# Altium project Iot_board_esp8266.PrjPcb (part 2 of 3)
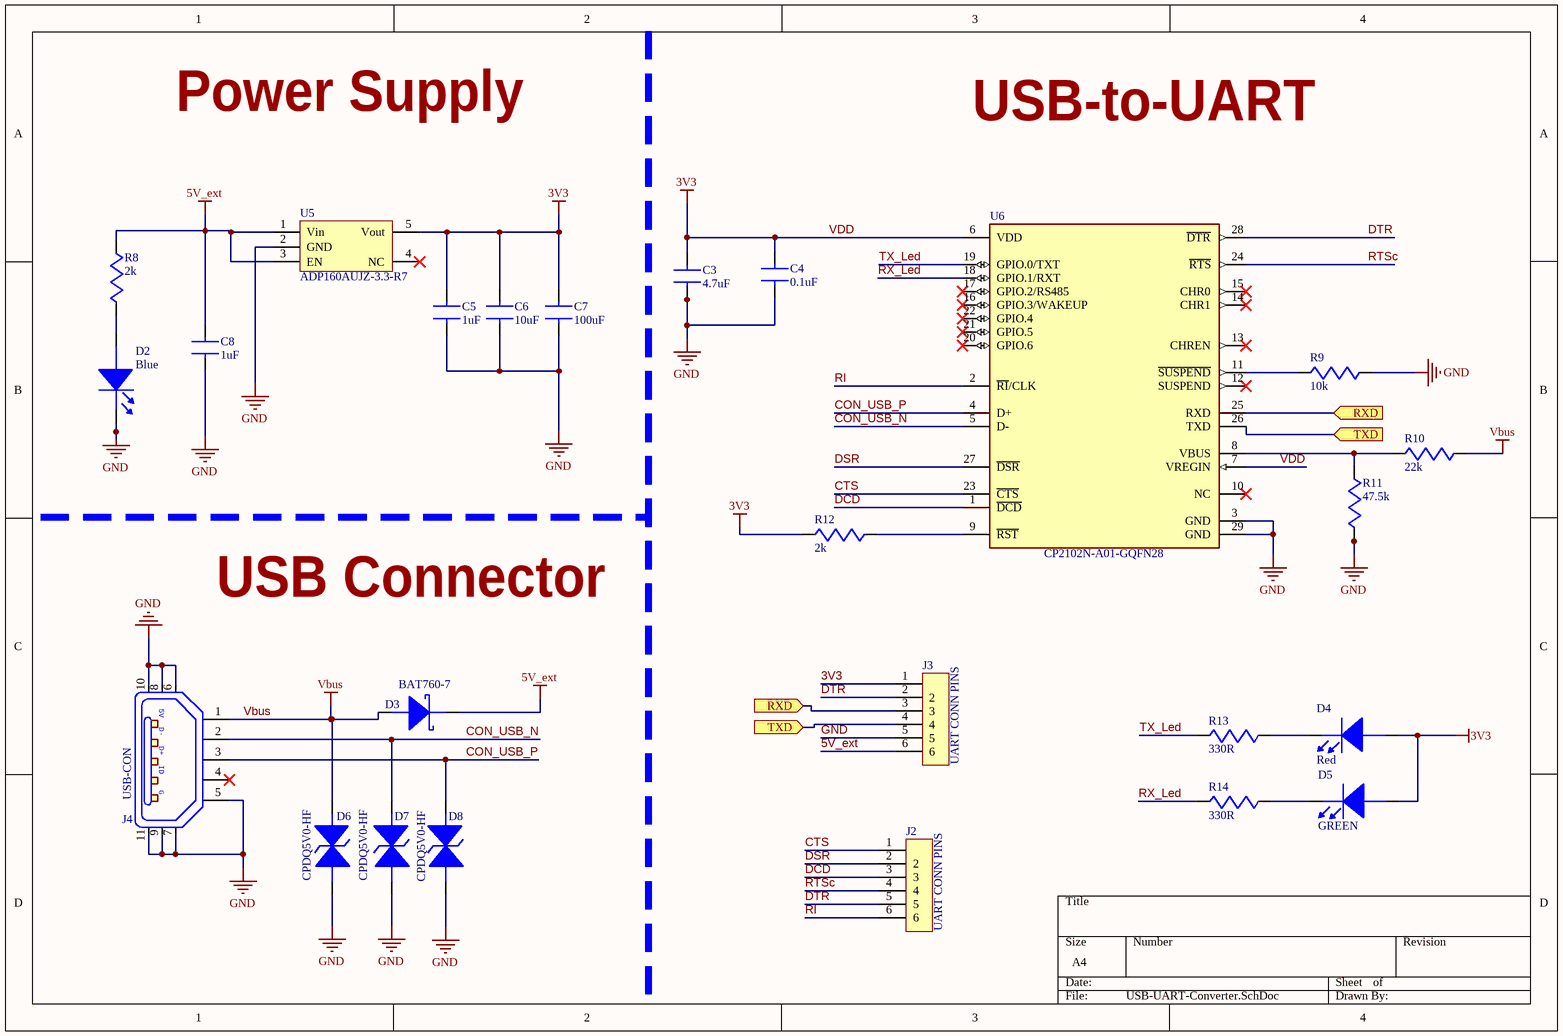
[diagram p3: USB-UART-Converter.SchDoc]

## Sheet USB-UART-Converter.SchDoc (continued)
### Library data of the parts
C3 = C0603C475K9PACTU: KEMET - C0603C475K9PACTU - SMD Multilayer Ceramic Capacitor, 4.7 µF, 6.3 V, 0603 [1608 Metric], ± 10%, X5R, C Series KEMET; Voltage Rating (DC): 6.3V; Dissipation Factor: 5%; Supplier 1: Digi-Key; Supplier Part Number 1: 399-3482-1-ND; Manufacturer: KEMET; Manufacturer Part Number: C0603C475K9PACTU; RoHS: Yes; Category: Ceramic Capacitors; Stock 1: 1092737; Pricing 1: 1=0,16000, 10=0,11500, 50=0,06520, 100=0,05410, 500=0,03792, 1000=0,03139 (USD); Mount: Surface Mount,PCB; Case/Package: 0603; Number of Pins: 2; Case Code (Metric): 1608; Case Code (Imperial): 0603; Dielectric Material: Ceramic; Contact Plating: Tin,Matte; Min Operating Temperature: -55°C; Max Operating Temperature: 85°C; Package Quantity: 1; Capacitance: 4.7uF; Tolerance: 10%; Packaging: Tape and Reel; Voltage Rating: 6.3V; Dielectric: X5R; Termination: SMD/SMT; Voltage: 6.3V; Series: C; Construction: Flat; Length: 1.6mm; Width: 0.031inch; Height: 0.8mm; Depth: 0.8mm; Thickness: 0.035inch; Lead Pitch: 0.7mm; Radiation Hardening: No; REACH SVHC: No SVHC; Lead Free: Lead Free; RoHS Compliant: Yes; ComponentLink1URL: https://datasheet.ciiva.com/145/docfinderpartnumber-c0603c475k9pactu-145072.pdf?src-supplier=Digi-Key; ComponentLink1Description: https://datasheet.ciiva.com/145/docfinderpartnumber-c0603c475k9pactu-145072.pdf?src-supplier=Digi-Key; ComponentLink2URL: https://datasheet.ciiva.com/7823/1732700-7823808.pdf?src-supplier=Element14; ComponentLink2Description: https://datasheet.ciiva.com/7823/1732700-7823808.pdf?src-supplier=Element14; ComponentLink3URL: https://datasheet.ciiva.com/28682/1789732-28682301.pdf?src-supplier=Element14; ComponentLink3Description: https://datasheet.ciiva.com/28682/1789732-28682301.pdf?src-supplier=Element14; ComponentLink4URL: https://datasheet.ciiva.com/7824/40889-7824047.pdf?src-supplier=Element14; ComponentLink4Description: https://datasheet.ciiva.com/7824/40889-7824047.pdf?src-supplier=Element14
C4 = C0603C104K5RACTU: KEMET - C0603C104K5RACTU - SMD Multilayer Ceramic Capacitor, 0.1 µF, 50 V, 0603 [1608 Metric], ± 10%, X7R, C Series KEMET; Capacitance: 100nF; Voltage Rating: 50V; Dissipation Factor: 2.5%; Supplier 1: Digi-Key; Supplier Part Number 1: 399-5089-1-ND; Manufacturer: KEMET; Manufacturer Part Number: C0603C104K5RACTU; RoHS: Yes; Category: Ceramic Capacitors; Stock 1: 4652879; Pricing 1: 1=0,12000, 10=0,08500, 50=0,04620, 100=0,03770, 500=0,02696, 1000=0,02118 (USD); Mount: Surface Mount; Case/Package: 0603; Number of Pins: 2; Case Code (Metric): 1608; Case Code (Imperial): 0603; Dielectric Material: Ceramic; Contact Plating: Tin,Matte; Min Operating Temperature: -55°C; Max Operating Temperature: 125°C; Tolerance: 10%; Packaging: Tape and Reel; Dielectric: X7R; Voltage Rating (DC): 50V; Package Quantity: 1; Termination: SMD/SMT; Voltage: 50V; Series: SMD Comm X7R; Length: 0.063inch; Width: 0.031inch; Height: 0.8mm; Depth: 0.8mm; Thickness: 0.034inch; Lead Pitch: 0.7mm; Radiation Hardening: No; REACH SVHC: No SVHC; RoHS Compliant: Yes
C5 C8 = C0603C105K8PACTU: Cap Ceramic 1uF 10V X5R 10% SMD 0603 85°C Paper T/R; Manufacturer: KEMET; Supplier 1: Digi-Key; Supplier Part Number 1: 399-3118-1-ND; Manufacturer Part Number: C0603C105K8PACTU; RoHS: Yes; Category: Ceramic Capacitors; Stock 1: 515304; Pricing 1: 1=0,10000, 10=0,05300, 50=0,02900, 100=0,02370, 500=0,01694, 1000=0,01331 (USD); Mount: Surface Mount; Case/Package: 0603; Number of Pins: 2; Case Code (Imperial): 0603; Case Code (Metric): 1608; Dielectric Material: Ceramic; Weight: 7.1E-05oz; Min Operating Temperature: -55°C; Max Operating Temperature: 85°C; Tolerance: 10%; Capacitance: 1uF; Packaging: Tape and Reel; Package Quantity: 1; Voltage Rating: 10V; Termination: SMD/SMT; Voltage Rating (DC): 10V; Dielectric: X5R; Voltage: 10V; Series: C; Construction: Flat; Length: 1.6mm; Width: 0.031inch; Height: 0.8mm; Depth: 0.8mm; Thickness: 0.035inch; Radiation Hardening: No; REACH SVHC: No SVHC; RoHS Compliant: Yes; Lead Free: Lead Free; ComponentLink1URL: https://datasheet.ciiva.com/11787/0900766b8116eb59-11787747.pdf?src-supplier=RSComponents; ComponentLink1Description: https://datasheet.ciiva.com/11787/0900766b8116eb59-11787747.pdf?src-supplier=RSComponents; ComponentLink2URL: https://datasheet.ciiva.com/6074/40889-6074647.pdf?src-supplier=Farnell; ComponentLink2Description: https://datasheet.ciiva.com/6074/40889-6074647.pdf?src-supplier=Farnell; ComponentLink3URL: https://datasheet.ciiva.com/28645/1831760-28645655.pdf?src-supplier=Element14; ComponentLink3Description: https://datasheet.ciiva.com/28645/1831760-28645655.pdf?src-supplier=Element14; ComponentLink4URL: https://datasheet.ciiva.com/26847/getdatasheetpartid-385480-26847548.pdf?src-supplier=Verical; ComponentLink4Description: https://datasheet.ciiva.com/26847/getdatasheetpartid-385480-26847548.pdf?src-supplier=Verical; ComponentLink5URL: https://datasheet.ciiva.com/7823/40889-7823998.pdf?src-supplier=Element14; ComponentLink5Description: https://datasheet.ciiva.com/7823/40889-7823998.pdf?src-supplier=Element14; ComponentLink6URL: https://datasheet.ciiva.com/7823/1929483-7823999.pdf?src-supplier=Element14; ComponentLink6Description: https://datasheet.ciiva.com/7823/1929483-7823999.pdf?src-supplier=Element14
C6 = C0603C106M9PACTU: KEMET - C0603C106M9PACTU - CAP, MLCC, X5R, 10UF, 6.3V, 0603; Dielectric Material: Ceramic; Tolerance: 20%; Supplier 1: Digi-Key; Supplier Part Number 1: 399-5504-1-ND; Manufacturer: KEMET; Manufacturer Part Number: C0603C106M9PACTU; RoHS: Yes; Category: Ceramic Capacitors; Stock 1: 149663; Pricing 1: 1=0,31000, 10=0,21100, 50=0,14040, 100=0,11930, 500=0,08422, 1000=0,07369 (USD); Mount: PCB,Surface Mount; Case/Package: 0603; Number of Pins: 2; Case Code (Imperial): 0603; Case Code (Metric): 1608; Min Operating Temperature: -55°C; Max Operating Temperature: 85°C; Capacitance: 10uF; Packaging: Tape and Reel; Voltage: 6.3V; Termination: SMD/SMT; Package Quantity: 4000; Voltage Rating: 6.3V; Voltage Rating (DC): 6.3V; Series: C0603C; Dielectric: X5R; Construction: Flat; Length: 1.6mm; Height: 0.8mm; Depth: 0.8mm; Radiation Hardening: No; REACH SVHC: No SVHC; RoHS Compliant: Yes; ComponentLink1URL: http://components.arrow.com/part/dataview/42932973S8313645N7429?src-supplier=Arrow+Electronics; ComponentLink1Description: http://components.arrow.com/part/dataview/42932973S8313645N7429?src-supplier=Arrow+Electronics; ComponentLink2URL: http://www.farnell.com/datasheets/2739682.pdf?src-supplier=Farnell; ComponentLink2Description: http://www.farnell.com/datasheets/2739682.pdf?src-supplier=Farnell; ComponentLink3URL: http://uk.rs-online.com/webdocs/1515/0900766b8151511d.pdf?src-supplier=RSComponents; ComponentLink3Description: http://uk.rs-online.com/webdocs/1515/0900766b8151511d.pdf?src-supplier=RSComponents; ComponentLink4URL: http://www.farnell.com/datasheets/1918694.pdf?src-supplier=Farnell; ComponentLink4Description: http://www.farnell.com/datasheets/1918694.pdf?src-supplier=Farnell; ComponentLink5URL: http://components.arrow.com/part/dataview/0323_00011321?src-supplier=Arrow+Europe; ComponentLink5Description: http://components.arrow.com/part/dataview/0323_00011321?src-supplier=Arrow+Europe; ComponentLink6URL: https://www.verical.com/server-webapp/html/getDatasheet?partID=353664&src-supplier=Verical; ComponentLink6Description: https://www.verical.com/server-webapp/html/getDatasheet?partID=353664&src-supplier=Verical; ComponentLink7URL: http://www.farnell.com/datasheets/2739682.pdf?src-supplier=Element14; ComponentLink7Description: http://www.farnell.com/datasheets/2739682.pdf?src-supplier=Element14; ComponentLink8URL: https://api.kemet.com/component-edge/download/datasheet/C0603C106M9PACTU.pdf?src-supplier=Digi-Key; ComponentLink8Description: https://api.kemet.com/component-edge/download/datasheet/C0603C106M9PACTU.pdf?src-supplier=Digi-Key; ComponentLink9URL: http://www.farnell.com/datasheets/2315129.pdf?src-supplier=Verical; ComponentLink9Description: http://www.farnell.com/datasheets/2315129.pdf?src-supplier=Verical; ComponentLink10URL: http://www.farnell.com/datasheets/2315129.pdf?src-supplier=Avnet+Asia; ComponentLink10Description: http://www.farnell.com/datasheets/2315129.pdf?src-supplier=Avnet+Asia; ComponentLink11URL: http://www.kemet.com/kemet/web/homepage/kechome.nsf/weben/ADB5E2666EC6BA90CA2570A50016092E/$file/KEM_C1005_Y5V_SMD.pdf?src-supplier=Avnet; ComponentLink11Description: http://www.kemet.com/kemet/web/homepage/kechome.nsf/weben/ADB5E2666EC6BA90CA2570A50016092E/$file/KEM_C1005_Y5V_SMD.pdf?src-supplier=Avnet; ComponentLink12URL: http://www.farnell.com/datasheets/2315129.pdf?src-supplier=RSComponents; ComponentLink12Description: http://www.farnell.com/datasheets/2315129.pdf?src-supplier=RSComponents; ComponentLink13URL: http://www.farnell.com/datasheets/2739682.pdf?src-supplier=Newark; ComponentLink13Description: http://www.farnell.com/datasheets/2739682.pdf?src-supplier=Newark; ComponentLink14URL: http://www.farnell.com/datasheets/2315129.pdf?src-supplier=Allied+Electronics; ComponentLink14Description: http://www.farnell.com/datasheets/2315129.pdf?src-supplier=Allied+Electronics; ComponentLink15URL: http://www.farnell.com/datasheets/2315129.pdf?src-supplier=Mouser; ComponentLink15Description: http://www.farnell.com/datasheets/2315129.pdf?src-supplier=Mouser; ComponentLink16URL: http://capacitoredge.kemet.com/capedge2/DataSheet?pn=C0603C106M9PAC7867&src-supplier=Avnet; ComponentLink16Description: http://capacitoredge.kemet.com/capedge2/DataSheet?pn=C0603C106M9PAC7867&src-supplier=Avnet; ComponentLink17URL: http://www.farnell.com/datasheets/2315129.pdf?src-supplier=Distrelec; ComponentLink17Description: http://www.farnell.com/datasheets/2315129.pdf?src-supplier=Distrelec; ComponentLink18URL: http://www.kemet.com/kemet/web/homepage/kechome.nsf/file/Commercial%20Ceramic%20Chips%20X5R%20Dielectric/$file/KEM_C1006_X5R_SMD.pdf?src-supplier=Element14; ComponentLink18Description: http://www.kemet.com/kemet/web/homepage/kechome.nsf/file/Commercial%20Ceramic%20Chips%20X5R%20Dielectric/$file/KEM_C1006_X5R_SMD.pdf?src-supplier=Element14; ComponentLink19URL: http://www.farnell.com/datasheets/2315129.pdf?src-supplier=TTI; ComponentLink19Description: http://www.farnell.com/datasheets/2315129.pdf?src-supplier=TTI; ComponentLink20URL: http://www.farnell.com/datasheets/2315129.pdf?src-supplier=Quest; ComponentLink20Description: http://www.farnell.com/datasheets/2315129.pdf?src-supplier=Quest; ComponentLink21URL: http://www.farnell.com/datasheets/2315129.pdf?src-supplier=TME; ComponentLink21Description: http://www.farnell.com/datasheets/2315129.pdf?src-supplier=TME
C7 = C1206C107M9PACTU: KEMET - C1206C107M9PACTU - CAP, 100µF, 6.3V, 20%, X5R, 1206; Dielectric Material: Ceramic; Tolerance: 2%; Dissipation Factor: 5%; Supplier 1: Digi-Key; Supplier Part Number 1: 399-5620-1-ND; Manufacturer: KEMET; Manufacturer Part Number: C1206C107M9PACTU; RoHS: Yes; Category: Ceramic Capacitors; Stock 1: 170758; Pricing 1: 1=1,10000, 10=0,86600, 50=0,75080, 100=0,64970, 500=0,49088, 1000=0,43312 (USD); Mount: Surface Mount,PCB; Case/Package: 1206; Number of Pins: 2; Case Code (Metric): 3216; Case Code (Imperial): 1206; Min Operating Temperature: -55°C; Max Operating Temperature: 85°C; Capacitance: 100uF; Voltage Rating: 6.3V; Voltage Rating (DC): 6.3V; Package Quantity: 1; Packaging: Tape and Reel; Termination: SMD/SMT; Voltage: 6.3V; Series: C; Construction: Flat; Dielectric: X5R; Length: 3.2mm; Width: 0.063inch; Height: 1.6mm; Depth: 1.6mm; Thickness: 0.071inch; Radiation Hardening: No; REACH SVHC: No SVHC; RoHS Compliant: Yes; Lead Free: Lead Free; ComponentLink1URL: https://datasheet.ciiva.com/6161/1732717-6161699.pdf?src-supplier=Farnell; ComponentLink1Description: https://datasheet.ciiva.com/6161/1732717-6161699.pdf?src-supplier=Farnell; ComponentLink2URL: https://datasheet.ciiva.com/7729/1732717-7729830.pdf?src-supplier=Element14; ComponentLink2Description: https://datasheet.ciiva.com/7729/1732717-7729830.pdf?src-supplier=Element14; ComponentLink3URL: https://datasheet.ciiva.com/7729/1732717-7729831.pdf?src-supplier=Element14; ComponentLink3Description: https://datasheet.ciiva.com/7729/1732717-7729831.pdf?src-supplier=Element14; ComponentLink4URL: https://datasheet.ciiva.com/14589/70095383-14589256.pdf?src-supplier=Allied+Electronics; ComponentLink4Description: https://datasheet.ciiva.com/14589/70095383-14589256.pdf?src-supplier=Allied+Electronics; ComponentLink5URL: https://datasheet.ciiva.com/22749/1918694-22749624.pdf?src-supplier=Element14; ComponentLink5Description: https://datasheet.ciiva.com/22749/1918694-22749624.pdf?src-supplier=Element14; ComponentLink6URL: https://datasheet.ciiva.com/6114/40889-6114911.pdf?src-supplier=Farnell; ComponentLink6Description: https://datasheet.ciiva.com/6114/40889-6114911.pdf?src-supplier=Farnell; ComponentLink7URL: https://datasheet.ciiva.com/14592/70095383-14592223.pdf?src-supplier=Allied+Electronics; ComponentLink7Description: https://datasheet.ciiva.com/14592/70095383-14592223.pdf?src-supplier=Allied+Electronics
D2 = LTST-C191TBKT: LED BLUE CLEAR 0603 SMD; Manufacturer: Vishay Lite-On; Lens Color: Colorless; Forward Voltage: 3.8V; Forward Current: 20mA; Viewing Angle: 130°; Lens Style: Diffused,Colorless,Clear,Rectangular; Dominant Wavelength: 475nm; Luminous Intensity: 180mcd; Wavelength: 468nm; Number of LEDs: 1; Reverse Voltage: 5V; Power Dissipation: 76mW; Max Power Dissipation: 75mW; Supplier 1: Digi-Key; Supplier Part Number 1: 160-1647-1-ND; Manufacturer Part Number: LTST-C191TBKT; RoHS: Yes; Category: LEDs; Stock 1: 244513; Pricing 1: 1=0,33000, 10=0,26200, 100=0,11780, 500=0,10640, 1000=0,08740, 2000=0,07600 (USD); Mount: Surface Mount; Case/Package: 0603; Number of Pins: 2; Color: Blue; Case Code (Metric): 1608; Case Code (Imperial): 0603; Min Operating Temperature: -20°C; Max Operating Temperature: 80°C; Packaging: Tape and Reel; Package Quantity: 1; Test Current: 20mA; Illumination Color: Blue; Lens Transparency: Clear; Number of Elements: 1; Length: 0.8mm; Width: 0.8mm; Height: 0.55mm; Depth: 1.6mm; Radiation Hardening: No; RoHS Compliant: Yes; Lead Free: Lead Free; ComponentLink1URL: https://datasheet.ciiva.com/2110/ltst-c191tbkt-2110256.pdf?src-supplier=Digi-Key; ComponentLink1Description: https://datasheet.ciiva.com/2110/ltst-c191tbkt-2110256.pdf?src-supplier=Digi-Key; ComponentLink2URL: https://datasheet.ciiva.com/12400/lite-on-ltst-c191tbkt-187207-12400737.pdf?src-supplier=Mouser; ComponentLink2Description: https://datasheet.ciiva.com/12400/lite-on-ltst-c191tbkt-187207-12400737.pdf?src-supplier=Mouser; ComponentLink3URL: https://datasheet.ciiva.com/19465/2047945-19465673.pdf?src-supplier=Jameco; ComponentLink3Description: https://datasheet.ciiva.com/19465/2047945-19465673.pdf?src-supplier=Jameco; ComponentLink4URL: https://datasheet.ciiva.com/11774/0900766b80dc02b4-11774413.pdf?src-supplier=RSComponents; ComponentLink4Description: https://datasheet.ciiva.com/11774/0900766b80dc02b4-11774413.pdf?src-supplier=RSComponents; ComponentLink5URL: https://datasheet.ciiva.com/15117/getdatasheetpartid-133342-15117680.pdf?src-supplier=Verical; ComponentLink5Description: https://datasheet.ciiva.com/15117/getdatasheetpartid-133342-15117680.pdf?src-supplier=Verical; ComponentLink6URL: https://datasheet.ciiva.com/16444/ltst-c191tbkt-16444756.pdf?src-supplier=Future+Electronics; ComponentLink6Description: https://datasheet.ciiva.com/16444/ltst-c191tbkt-16444756.pdf?src-supplier=Future+Electronics; ComponentLink7URL: https://datasheet.ciiva.com/26913/ltst-c191tbkt-26913718.pdf?src-supplier=IIIC; ComponentLink7Description: https://datasheet.ciiva.com/26913/ltst-c191tbkt-26913718.pdf?src-supplier=IIIC; ComponentLink8URL: https://datasheet.ciiva.com/2110/s-110-ltst-c191tbkt-2110257.pdf?src-supplier=Digi-Key; ComponentLink8Description: https://datasheet.ciiva.com/2110/s-110-ltst-c191tbkt-2110257.pdf?src-supplier=Digi-Key
D3 = BAT760-7: DIODE SCHOTTKY 30V 1A SOD323; Manufacturer: Diodes; Element Configuration: Single; Peak Non-Repetitive Surge Current: 5.5A; Polarity: Standard; Capacitance: 25pF; Max Power Dissipation: 235mW; Forward Voltage: 550mV; Max Reverse Current: 50uA; Supplier 1: Digi-Key; Supplier Part Number 1: BAT760DICT-ND; Manufacturer Part Number: BAT760-7; RoHS: Yes; Category: Schottky Diodes; Stock 1: 214; Pricing 1: 1=0,53000, 10=0,45000, 100=0,31200, 500=0,24360, 1000=0,19800 (USD); Mount: Surface Mount; Number of Pins: 2; Weight: 0.000173oz; Contact Plating: Tin,Matte; Min Operating Temperature: -65°C; Max Operating Temperature: 150°C; Max Repetitive Reverse Voltage (Vrrm): 30V; Forward Current: 1A; Max Reverse Voltage (DC): 30V; Voltage Rating (DC): 30V; Current Rating: 1A; Output Current: 1A; Max Forward Surge Current (Ifsm): 5.5A; Average Rectified Current: 1A; Termination: SMD/SMT; Package Quantity: 3000; Packaging: Tape and Reel; Length: 1.8mm; Width: 1.4mm; Height: 1mm; Radiation Hardening: No; Lead Free: Lead Free; REACH SVHC: No SVHC; ComponentLink1URL: https://datasheet.ciiva.com/1178/ds30498-1178033.pdf?src-supplier=Element14; ComponentLink1Description: https://datasheet.ciiva.com/1178/ds30498-1178033.pdf?src-supplier=Element14; ComponentLink2URL: https://datasheet.ciiva.com/4715/ds30498-63155-4715521.pdf?src-supplier=Mouser; ComponentLink2Description: https://datasheet.ciiva.com/4715/ds30498-63155-4715521.pdf?src-supplier=Mouser; ComponentLink3URL: https://datasheet.ciiva.com/8301/ds30498-8301400.pdf?src-supplier=Avnet; ComponentLink3Description: https://datasheet.ciiva.com/8301/ds30498-8301400.pdf?src-supplier=Avnet; ComponentLink4URL: https://datasheet.ciiva.com/26788/bat760-7-26788796.pdf?src-supplier=IIIC; ComponentLink4Description: https://datasheet.ciiva.com/26788/bat760-7-26788796.pdf?src-supplier=IIIC; ComponentLink5URL: https://datasheet.ciiva.com/22695/1670989-22695799.pdf?src-supplier=Element14; ComponentLink5Description: https://datasheet.ciiva.com/22695/1670989-22695799.pdf?src-supplier=Element14; ComponentLink6URL: https://datasheet.ciiva.com/914/ds30498-914553.pdf?src-supplier=Digi-Key; ComponentLink6Description: https://datasheet.ciiva.com/914/ds30498-914553.pdf?src-supplier=Digi-Key; ComponentLink7URL: https://datasheet.ciiva.com/914/ds30498-914551.pdf?src-supplier=Digi-Key; ComponentLink7Description: https://datasheet.ciiva.com/914/ds30498-914551.pdf?src-supplier=Digi-Key; ComponentLink8URL: https://datasheet.ciiva.com/914/ds30498-914552.pdf?src-supplier=Digi-Key; ComponentLink8Description: https://datasheet.ciiva.com/914/ds30498-914552.pdf?src-supplier=Digi-Key
D4 = HSMS-C190: AVAGO TECHNOLOGIES - HSMS-C190 - LED, RED, 10MCD, 626NM; Manufacturer: Broadcom Avago; Lens Color: White; Forward Current: 20mA; Forward Voltage: 2.1V; Lens Style: Diffused,Colorless,Rectangular; Viewing Angle: 170°; Number of LEDs: 1; Reverse Voltage: 5V; Lens Transparency: Diffused; Power Dissipation: 52mW; Supplier 1: Digi-Key; Supplier Part Number 1: 516-1422-1-ND; Manufacturer Part Number: HSMS-C190; RoHS: Yes; Category: LEDs; Stock 1: 82017; Pricing 1: 1=0,37000, 10=0,29300, 100=0,13140, 500=0,11872, 1000=0,09752, 2000=0,08480 (USD); Mount: Surface Mount; Case/Package: 0603; Number of Pins: 2; Color: Red; Case Code (Metric): 1608; Case Code (Imperial): 0603; Min Operating Temperature: -40°C; Max Operating Temperature: 85°C; Package Quantity: 4000; Luminous Intensity: 10mcd; Packaging: Tape and Reel; Dominant Wavelength: 626nm; Test Current: 20mA; Wavelength: 626nm; Illumination Color: Red; Number of Elements: 1; Power Rating: 52mW; Series: -; Length: 1.6mm; Width: 0.8mm; Height: 0.8mm; Depth: 0.8mm; Radiation Hardening: No; RoHS Compliant: Yes; Lead Free: Lead Free; REACH SVHC: No SVHC; ComponentLink1URL: https://datasheet.ciiva.com/4688/v02-0551en+ds+hsmx-cxxx+05mar2012-13514-4688272.pdf?src-supplier=Mouser; ComponentLink1Description: https://datasheet.ciiva.com/4688/v02-0551en+ds+hsmx-cxxx+05mar2012-13514-4688272.pdf?src-supplier=Mouser; ComponentLink2URL: https://datasheet.ciiva.com/11774/0900766b80ad69c9-11774200.pdf?src-supplier=RSComponents; ComponentLink2Description: https://datasheet.ciiva.com/11774/0900766b80ad69c9-11774200.pdf?src-supplier=RSComponents; ComponentLink3URL: https://datasheet.ciiva.com/15117/getdatasheetpartid-110718-15117496.pdf?src-supplier=Verical; ComponentLink3Description: https://datasheet.ciiva.com/15117/getdatasheetpartid-110718-15117496.pdf?src-supplier=Verical; ComponentLink4URL: https://datasheet.ciiva.com/29280/180663-da-01-en-chip-led-hsms-c190-rot-29280620.pdf?src-supplier=Conrad; ComponentLink4Description: https://datasheet.ciiva.com/29280/180663-da-01-en-chip-led-hsms-c190-rot-29280620.pdf?src-supplier=Conrad; ComponentLink5URL: https://datasheet.ciiva.com/14172/swseriehsmx-c150toc190-e-14172170.pdf?src-supplier=Distrelec; ComponentLink5Description: https://datasheet.ciiva.com/14172/swseriehsmx-c150toc190-e-14172170.pdf?src-supplier=Distrelec
D5 = LGL29K-G2J1-24-Z: LED Uni-Color Green 572nm 2-Pin Chip 0603(1608Metric) T/R; Manufacturer: Osram Opto; Lens Color: White; Forward Current: 20mA; Forward Voltage: 2.2V; Luminous Intensity: 5.6mcd; Viewing Angle: 160°; Number of LEDs: 1; Lens Style: Flat,Diffused,Colorless,Rectangular; Reverse Voltage: 12V; Test Current: 2mA; Dominant Wavelength: 570nm; Luminous Flux: 0.012lm; Lens Transparency: Diffused; Lens Size: 0.8mm; Supplier 1: Digi-Key; Supplier Part Number 1: 475-2709-1-ND; Manufacturer Part Number: LGL29K-G2J1-24-Z; RoHS: Yes; Category: Uncategorized; Stock 1: 191201; Pricing 1: 1=0,47000, 10=0,30800, 100=0,20530, 500=0,14198, 1000=0,11832, 2000=0,10649 (USD); Mount: Surface Mount; Case/Package: 0603; Number of Pins: 2; Color: Green; Case Code (Imperial): 0603; Case Code (Metric): 1608; Min Operating Temperature: -40°C; Max Operating Temperature: 100°C; Packaging: Tape and Reel; Number of Elements: 1; Illumination Color: Green; Package Quantity: 5000; Length: 1.3mm; Width: 0.8mm; Height: 0.65mm; Depth: 0.8mm; Radiation Hardening: No; ComponentLink1URL: https://datasheet.ciiva.com/4689/g-l29k-39844-4689584.pdf?src-supplier=Mouser; ComponentLink1Description: https://datasheet.ciiva.com/4689/g-l29k-39844-4689584.pdf?src-supplier=Mouser; ComponentLink2URL: https://datasheet.ciiva.com/15198/getdatasheetpartid-571127-15198411.pdf?src-supplier=Verical; ComponentLink2Description: https://datasheet.ciiva.com/15198/getdatasheetpartid-571127-15198411.pdf?src-supplier=Verical; ComponentLink3URL: https://datasheet.ciiva.com/2112/00077107-0-2112886.pdf?src-supplier=Digi-Key; ComponentLink3Description: https://datasheet.ciiva.com/2112/00077107-0-2112886.pdf?src-supplier=Digi-Key; ComponentLink4URL: https://datasheet.ciiva.com/2112/00077107-0-2112887.pdf?src-supplier=Digi-Key; ComponentLink4Description: https://datasheet.ciiva.com/2112/00077107-0-2112887.pdf?src-supplier=Digi-Key; ComponentLink5URL: https://datasheet.ciiva.com/2112/00077107-0-2112888.pdf?src-supplier=Digi-Key; ComponentLink5Description: https://datasheet.ciiva.com/2112/00077107-0-2112888.pdf?src-supplier=Digi-Key
D6-D8 = CPDQ5V0-HF: TVS DIODE 5V 18.6V 0402/SOD923F; Manufacturer: Comchip; Min Breakdown Voltage: 5.6V; Clamping Voltage: 7.3V; Peak Pulse Power: 174W; Power Line Protection: No; Peak Pulse Current: 9.4A; Diode Type: ZENER; Capacitance: 15pF; Number of Bidirectional Channels: 1; Supplier 1: Digi-Key; Supplier Part Number 1: 641-1478-1-ND; Manufacturer Part Number: CPDQ5V0-HF; RoHS: Yes; Category: TVS Diodes; Pricing 1: 1=0,28000, 10=0,19500, 100=0,09510, 500=0,07932, 1000=0,05511, 2000=0,04777 (USD); Mount: Surface Mount; Case/Package: 0402; Min Operating Temperature: -40°C; Max Operating Temperature: 125°C; Packaging: Tape and Reel; Package Quantity: 8000; Reverse Standoff Voltage: 5V; Breakdown Voltage: 5.6V; Resistor Type: Zener; Series: -; Operating Supply Voltage: 5V; RoHS Compliant: Yes; ComponentLink1URL: https://datasheet.ciiva.com/6577/cpdq5v0-hf20reva825126-6577872.pdf?src-supplier=Digi-Key; ComponentLink1Description: https://datasheet.ciiva.com/6577/cpdq5v0-hf20reva825126-6577872.pdf?src-supplier=Digi-Key; ComponentLink2URL: https://datasheet.ciiva.com/12545/cpdq5v0-hf20reva825126-218795-12545530.pdf?src-supplier=Mouser; ComponentLink2Description: https://datasheet.ciiva.com/12545/cpdq5v0-hf20reva825126-218795-12545530.pdf?src-supplier=Mouser
J2 J3 = UART CONN PINS: Manufacturer: Amphenol FCI; Manufacturer Part Number: 66951-010LF; Current Rating: 3A; Voltage Rating: 1.25kV; Contact Resistance: 15mR; Gender: Female; Connector Type: Receptacle,Socket; Number of Positions: 10; Pitch: 2.54mm; Supplier 1: Digi-Key; RoHS: Yes; Category: Headers and Wire Housings; Stock 1: 757; Pricing 1: 1=2,02000, 10=1,83400, 100=1,57210, 500=1,31006, 1000=1,12290, 5000=0,99564, 10000=0,97318 (USD); Mount: Through Hole; Color: Black; Contact Plating: Gold; Contact Material: Copper,Brass; Housing Color: Black; Housing Material: Thermoplastic; Min Operating Temperature: -65°C; Max Operating Temperature: 125°C; Package Quantity: 23; Number of Rows: 1; Packaging: Rail/Tube; Contact Gender: Female; Orientation: Straight; Termination: Solder; Max Voltage Rating (AC): 1.25kV; Number of Contacts: 10; Length: 25.4mm; Width: 5.08mm; Depth: 5.08mm; Lead Free: Lead Free; ComponentLink1URL: https://datasheet.ciiva.com/746/66951-746016.pdf?src-supplier=Digi-Key; ComponentLink1Description: https://datasheet.ciiva.com/746/66951-746016.pdf?src-supplier=Digi-Key; ComponentLink2URL: https://datasheet.ciiva.com/5155/66951-85357-5155344.pdf?src-supplier=Mouser; ComponentLink2Description: https://datasheet.ciiva.com/5155/66951-85357-5155344.pdf?src-supplier=Mouser; ComponentLink3URL: https://datasheet.ciiva.com/10137/66951-10137498.pdf?src-supplier=Avnet; ComponentLink3Description: https://datasheet.ciiva.com/10137/66951-10137498.pdf?src-supplier=Avnet; ComponentLink4URL: https://datasheet.ciiva.com/16727/66951-16727150.pdf?src-supplier=Avnet+Europe; ComponentLink4Description: https://datasheet.ciiva.com/16727/66951-16727150.pdf?src-supplier=Avnet+Europe; Supplier Part Number 1: 609-2240-ND
J4 = 10118193-0001LF: CONN USB MICRO B RECPT SMT R/A; Manufacturer: Amphenol FCI; Number of Terminals/Pins: 5; Gender: Female; Connector Type: USB,Receptacle; Number of Ports: 1; Current Rating: 1.8A; Insulation Resistance: 1GR; Max Voltage Rating (AC): 100V; Pitch: 0.65mm; Supplier 1: Digi-Key; Supplier Part Number 1: 609-4616-1-ND; Manufacturer Part Number: 10118193-0001LF; RoHS: Yes; Category: USB Connectors; Stock 1: 68220; Pricing 1: 1=0,45000, 10=0,43000, 25=0,36840, 50=0,31320, 100=0,30090, 250=0,27016, 500=0,25788 (USD); Mount: Surface Mount,Horizontal; Contact Plating: Gold; Contact Material: Copper Alloy; Color: Black; Housing Material: Polymer; Min Operating Temperature: -55°C; Max Operating Temperature: 85°C; Termination: Solder; Packaging: Tape and Reel; Number of Contacts: 5; Orientation: Right Angle; Package Quantity: 1200; Voltage Rating: 100V; Features: Shielded; Length: 7.86mm; Depth: 5.67mm; Radiation Hardening: No; Flammability Rating: UL94 V-0; ComponentLink1URL: https://datasheet.ciiva.com/851/10118193-851106.pdf?src-supplier=Digi-Key; ComponentLink1Description: https://datasheet.ciiva.com/851/10118193-851106.pdf?src-supplier=Digi-Key; ComponentLink2URL: https://datasheet.ciiva.com/26853/getdatasheetpartid-418618-26853893.pdf?src-supplier=Verical; ComponentLink2Description: https://datasheet.ciiva.com/26853/getdatasheetpartid-418618-26853893.pdf?src-supplier=Verical; ComponentLink3URL: https://datasheet.ciiva.com/4598/10118193ac-197151-4598799.pdf?src-supplier=Mouser; ComponentLink3Description: https://datasheet.ciiva.com/4598/10118193ac-197151-4598799.pdf?src-supplier=Mouser; ComponentLink4URL: https://datasheet.ciiva.com/14802/10118193-0001lf-webpage-14802386.pdf?src-supplier=Arrow+Electronics; ComponentLink4Description: https://datasheet.ciiva.com/14802/10118193-0001lf-webpage-14802386.pdf?src-supplier=Arrow+Electronics; ComponentLink5URL: https://datasheet.ciiva.com/851/10118193-851107.pdf?src-supplier=Digi-Key; ComponentLink5Description: https://datasheet.ciiva.com/851/10118193-851107.pdf?src-supplier=Digi-Key; ComponentLink6URL: https://datasheet.ciiva.com/851/10118193-851108.pdf?src-supplier=Digi-Key; ComponentLink6Description: https://datasheet.ciiva.com/851/10118193-851108.pdf?src-supplier=Digi-Key; ComponentLink7URL: https://datasheet.ciiva.com/14618/70236827-14618887.pdf?src-supplier=Allied+Electronics; ComponentLink7Description: https://datasheet.ciiva.com/14618/70236827-14618887.pdf?src-supplier=Allied+Electronics
R8 R12 = CRCW06032K00FKEA: D11/CRCW0603 100 2K 1% ET1 e3; Manufacturer: Vishay; Power Rating: 100mW; Resistance: 2kR; Voltage Rating: 75V; Temperature Coefficient: 100ppm/°C; Supplier 1: Digi-Key; Supplier Part Number 1: 541-2.00KHCT-ND; Manufacturer Part Number: CRCW06032K00FKEA; RoHS: Yes; Category: Chip SMD Resistors; Stock 1: 244384; Pricing 1: 1=0,10000, 10=0,03400, 100=0,01390, 1000=0,00624, 2500=0,00542 (USD); Mount: Surface Mount; Case/Package: 0603; Number of Pins: 2; Case Code (Imperial): 0603; Case Code (Metric): 1608; Contact Plating: Tin,Lead; Size Code: 0603; Weight: 7.1E-05oz; Min Operating Temperature: -55°C; Max Operating Temperature: 155°C; Tolerance: 1%; Packaging: Tape and Reel; Resistor Type: Thick Film; Number of Terminations: 2; Max Power Dissipation: 100mW; Package Quantity: 10; Voltage Rating (DC): 75V; Series: CRCW; Termination: Solder; Resistance Tolerance: 1%; Construction: Rectangular; Features: Automotive AEC-Q200; Technology: THICK FILM; Length: 1.55mm; Width: 0.85mm; Height: 0.45mm; Depth: 0.85mm; Radiation Hardening: No; REACH SVHC: Unknown; RoHS Compliant: Yes; Lead Free: Lead Free; Military Standard: Not; ComponentLink1URL: https://datasheet.ciiva.com/7673/1720486-7673525.pdf?src-supplier=Element14; ComponentLink1Description: https://datasheet.ciiva.com/7673/1720486-7673525.pdf?src-supplier=Element14; ComponentLink2URL: https://datasheet.ciiva.com/28621/125364-28621397.pdf?src-supplier=Element14; ComponentLink2Description: https://datasheet.ciiva.com/28621/125364-28621397.pdf?src-supplier=Element14; ComponentLink3URL: https://datasheet.ciiva.com/3257/dcrcwe3-3257366.pdf?src-supplier=Avnet; ComponentLink3Description: https://datasheet.ciiva.com/3257/dcrcwe3-3257366.pdf?src-supplier=Avnet; ComponentLink4URL: https://datasheet.ciiva.com/3257/dcrcwe3-3257367.pdf?src-supplier=Avnet; ComponentLink4Description: https://datasheet.ciiva.com/3257/dcrcwe3-3257367.pdf?src-supplier=Avnet; ComponentLink5URL: https://datasheet.ciiva.com/16882/dcrcw-16882855.pdf?src-supplier=Avnet+Europe; ComponentLink5Description: https://datasheet.ciiva.com/16882/dcrcw-16882855.pdf?src-supplier=Avnet+Europe; ComponentLink6URL: https://datasheet.ciiva.com/5551/dcrcwe3-109170-5551994.pdf?src-supplier=Mouser; ComponentLink6Description: https://datasheet.ciiva.com/5551/dcrcwe3-109170-5551994.pdf?src-supplier=Mouser; ComponentLink7URL: https://datasheet.ciiva.com/16755/70201119-16755770.pdf?src-supplier=Allied+Electronics; ComponentLink7Description: https://datasheet.ciiva.com/16755/70201119-16755770.pdf?src-supplier=Allied+Electronics; ComponentLink8URL: https://datasheet.ciiva.com/26314/fld-crcw-e3-data-en-26314682.pdf?src-supplier=Distrelec; ComponentLink8Description: https://datasheet.ciiva.com/26314/fld-crcw-e3-data-en-26314682.pdf?src-supplier=Distrelec; ComponentLink9URL: https://datasheet.ciiva.com/2465/dcrcwe3-2465564.pdf?src-supplier=Digi-Key; ComponentLink9Description: https://datasheet.ciiva.com/2465/dcrcwe3-2465564.pdf?src-supplier=Digi-Key; ComponentLink10URL: https://datasheet.ciiva.com/16765/70201119-16765388.pdf?src-supplier=Allied+Electronics; ComponentLink10Description: https://datasheet.ciiva.com/16765/70201119-16765388.pdf?src-supplier=Allied+Electronics; ComponentLink11URL: https://datasheet.ciiva.com/2465/dcrcwe3-2465565.pdf?src-supplier=Digi-Key; ComponentLink11Description: https://datasheet.ciiva.com/2465/dcrcwe3-2465565.pdf?src-supplier=Digi-Key; ComponentLink12URL: https://datasheet.ciiva.com/2465/dcrcwe3-2465566.pdf?src-supplier=Digi-Key; ComponentLink12Description: https://datasheet.ciiva.com/2465/dcrcwe3-2465566.pdf?src-supplier=Digi-Key
R9 = CRCW060310K0FKEA: VISHAY - CRCW060310K0FKEA - SMD Chip Resistor, 0603 [1608 Metric], 10 kohm, CRCW e3 Series, 75 V, Thick Film, 100 mW; Resistance: 10kR; Power Rating: 100mW; Voltage Rating: 75V; Temperature Coefficient: 100ppm/°C; Tolerance: 1%; Supplier 1: Digi-Key; Supplier Part Number 1: 541-10.0KHCT-ND; Manufacturer: Vishay; Manufacturer Part Number: CRCW060310K0FKEA; RoHS: Yes; Category: Chip SMD Resistors; Pricing 1: 1=0,10000, 10=0,03400, 100=0,01390, 1000=0,00624, 2500=0,00542 (USD); Case/Package: 0603; Number of Pins: 2; Case Code (Metric): 1608; Case Code (Imperial): 0603; Contact Plating: Tin,Lead; Weight: 7.1E-05oz; Size Code: 0603; Min Operating Temperature: -55°C; Max Operating Temperature: 155°C; Packaging: Tape and Reel; Package Quantity: 10; Termination: SMD/SMT; Resistor Type: Thick Film; Series: CRCW; Resistance Tolerance: 1%; Max Power Dissipation: 100mW; Voltage Rating (DC): 75V; Number of Terminations: 2; Features: Automotive AEC-Q200; Construction: Rectangular; Technology: THICK FILM; Length: 1.55mm; Width: 0.033inch; Height: 0.45mm; Depth: 0.85mm; Radiation Hardening: No; REACH SVHC: Unknown; Military Standard: Not; Lead Free: Lead Free; RoHS Compliant: Yes; ComponentLink1URL: https://datasheet.ciiva.com/11809/0900766b80d98afc-11809037.pdf?src-supplier=RSComponents; ComponentLink1Description: https://datasheet.ciiva.com/11809/0900766b80d98afc-11809037.pdf?src-supplier=RSComponents; ComponentLink2URL: https://datasheet.ciiva.com/16886/dcrcw-16886037.pdf?src-supplier=Avnet+Europe; ComponentLink2Description: https://datasheet.ciiva.com/16886/dcrcw-16886037.pdf?src-supplier=Avnet+Europe; ComponentLink3URL: https://datasheet.ciiva.com/26821/getdatasheetpartid-86831-26821109.pdf?src-supplier=Verical; ComponentLink3Description: https://datasheet.ciiva.com/26821/getdatasheetpartid-86831-26821109.pdf?src-supplier=Verical; ComponentLink4URL: https://datasheet.ciiva.com/16754/70201119-16754710.pdf?src-supplier=Allied+Electronics; ComponentLink4Description: https://datasheet.ciiva.com/16754/70201119-16754710.pdf?src-supplier=Allied+Electronics; ComponentLink5URL: https://datasheet.ciiva.com/16719/70201119-16719704.pdf?src-supplier=Allied+Electronics; ComponentLink5Description: https://datasheet.ciiva.com/16719/70201119-16719704.pdf?src-supplier=Allied+Electronics; ComponentLink6URL: https://datasheet.ciiva.com/2465/dcrcwe3-2465513.pdf?src-supplier=Digi-Key; ComponentLink6Description: https://datasheet.ciiva.com/2465/dcrcwe3-2465513.pdf?src-supplier=Digi-Key; ComponentLink7URL: https://datasheet.ciiva.com/5543/dcrcwe3-109170-5543001.pdf?src-supplier=Mouser; ComponentLink7Description: https://datasheet.ciiva.com/5543/dcrcwe3-109170-5543001.pdf?src-supplier=Mouser; ComponentLink8URL: https://datasheet.ciiva.com/2465/dcrcwe3-2465514.pdf?src-supplier=Digi-Key; ComponentLink8Description: https://datasheet.ciiva.com/2465/dcrcwe3-2465514.pdf?src-supplier=Digi-Key; ComponentLink9URL: https://datasheet.ciiva.com/46385/1697337-46385498.pdf?src-supplier=Element14; ComponentLink9Description: https://datasheet.ciiva.com/46385/1697337-46385498.pdf?src-supplier=Element14; ComponentLink10URL: https://datasheet.ciiva.com/2465/dcrcwe3-2465515.pdf?src-supplier=Digi-Key; ComponentLink10Description: https://datasheet.ciiva.com/2465/dcrcwe3-2465515.pdf?src-supplier=Digi-Key; ComponentLink11URL: https://datasheet.ciiva.com/3256/dcrcwe3-3256939.pdf?src-supplier=Avnet; ComponentLink11Description: https://datasheet.ciiva.com/3256/dcrcwe3-3256939.pdf?src-supplier=Avnet; ComponentLink12URL: https://datasheet.ciiva.com/3256/dcrcwe3-3256940.pdf?src-supplier=Avnet; ComponentLink12Description: https://datasheet.ciiva.com/3256/dcrcwe3-3256940.pdf?src-supplier=Avnet; ComponentLink13URL: https://datasheet.ciiva.com/16209/dcrcwe3-16209164.pdf?src-supplier=Future+Electronics; ComponentLink13Description: https://datasheet.ciiva.com/16209/dcrcwe3-16209164.pdf?src-supplier=Future+Electronics; ComponentLink14URL: https://datasheet.ciiva.com/26314/fld-crcw-e3-data-en-26314749.pdf?src-supplier=Distrelec; ComponentLink14Description: https://datasheet.ciiva.com/26314/fld-crcw-e3-data-en-26314749.pdf?src-supplier=Distrelec
R10 = CRCW060322K0FKEA: VISHAY - CRCW060322K0FKEA - Surface Mount Thick Film Resistor, AEC-Q200 CRCW Series, 22 kohm, 100 mW, - 1%, 75 V RoHS Compliant: Yes; Resistance: 22kR; Power Rating: 100mW; Voltage Rating: 75V; Temperature Coefficient: 100ppm/°C; Supplier 1: Digi-Key; Supplier Part Number 1: 541-22.0KHCT-ND; Manufacturer: Vishay; Manufacturer Part Number: CRCW060322K0FKEA; RoHS: Yes; Category: Chip SMD Resistors; Stock 1: 142; Pricing 1: 1=0,10000, 10=0,03400, 100=0,01390, 1000=0,00624, 2500=0,00542 (USD); Mount: Surface Mount; Case/Package: 0603; Case Code (Imperial): 0603; Case Code (Metric): 1608; Contact Plating: Tin; Weight: 7.1E-05oz; Size Code: 0603; Min Operating Temperature: -55°C; Max Operating Temperature: 155°C; Resistor Type: Thick Film; Tolerance: 1%; Packaging: Tape and Reel; Series: CRCW; Number of Terminations: 2; Termination: SMD/SMT; Max Power Dissipation: 100mW; Resistance Tolerance: 1%; Construction: Rectangular; Package Quantity: 10; Voltage Rating (DC): 75V; Features: Automotive AEC-Q200; Technology: THICK FILM; Length: 1.55mm; Width: 0.85mm; Height: 0.45mm; Depth: 0.85mm; Radiation Hardening: No; RoHS Compliant: Yes; REACH SVHC: Unknown; Military Standard: Not; Lead Free: Lead Free; ComponentLink1URL: https://datasheet.ciiva.com/11818/0900766b80d98afc-11818177.pdf?src-supplier=RSComponents; ComponentLink1Description: https://datasheet.ciiva.com/11818/0900766b80d98afc-11818177.pdf?src-supplier=RSComponents; ComponentLink2URL: https://datasheet.ciiva.com/15159/getdatasheetpartid-32846-15159349.pdf?src-supplier=Verical; ComponentLink2Description: https://datasheet.ciiva.com/15159/getdatasheetpartid-32846-15159349.pdf?src-supplier=Verical; ComponentLink3URL: https://datasheet.ciiva.com/2466/dcrcwe3-2466263.pdf?src-supplier=Digi-Key; ComponentLink3Description: https://datasheet.ciiva.com/2466/dcrcwe3-2466263.pdf?src-supplier=Digi-Key; ComponentLink4URL: https://datasheet.ciiva.com/7672/1697337-7672871.pdf?src-supplier=Element14; ComponentLink4Description: https://datasheet.ciiva.com/7672/1697337-7672871.pdf?src-supplier=Element14; ComponentLink5URL: https://datasheet.ciiva.com/2466/dcrcwe3-2466264.pdf?src-supplier=Digi-Key; ComponentLink5Description: https://datasheet.ciiva.com/2466/dcrcwe3-2466264.pdf?src-supplier=Digi-Key; ComponentLink6URL: https://datasheet.ciiva.com/7673/1720486-7673144.pdf?src-supplier=Element14; ComponentLink6Description: https://datasheet.ciiva.com/7673/1720486-7673144.pdf?src-supplier=Element14; ComponentLink7URL: https://datasheet.ciiva.com/16427/dcrcwe3-16427336.pdf?src-supplier=Future+Electronics; ComponentLink7Description: https://datasheet.ciiva.com/16427/dcrcwe3-16427336.pdf?src-supplier=Future+Electronics; ComponentLink8URL: https://datasheet.ciiva.com/16893/dcrcwe3-16893896.pdf?src-supplier=Avnet+Europe; ComponentLink8Description: https://datasheet.ciiva.com/16893/dcrcwe3-16893896.pdf?src-supplier=Avnet+Europe; ComponentLink9URL: https://datasheet.ciiva.com/2466/dcrcwe3-2466265.pdf?src-supplier=Digi-Key; ComponentLink9Description: https://datasheet.ciiva.com/2466/dcrcwe3-2466265.pdf?src-supplier=Digi-Key; ComponentLink10URL: https://datasheet.ciiva.com/8339/dcrcwe3-8339961.pdf?src-supplier=Avnet; ComponentLink10Description: https://datasheet.ciiva.com/8339/dcrcwe3-8339961.pdf?src-supplier=Avnet; ComponentLink11URL: https://datasheet.ciiva.com/16767/70201119-16767417.pdf?src-supplier=Allied+Electronics; ComponentLink11Description: https://datasheet.ciiva.com/16767/70201119-16767417.pdf?src-supplier=Allied+Electronics; ComponentLink12URL: https://datasheet.ciiva.com/26314/fld-crcw-e3-data-en-26314666.pdf?src-supplier=Distrelec; ComponentLink12Description: https://datasheet.ciiva.com/26314/fld-crcw-e3-data-en-26314666.pdf?src-supplier=Distrelec
R11 = CRCW060347K5FKEA: Resistor;  Thick Film;  47.5 Kilohms;  0.1 W;  1%;  SMT;  0603;  TCR 37 ppm/DegC; Manufacturer: Vishay; Resistance: 47.5kR; Power Rating: 100mW; Temperature Coefficient: 100ppm/°C; Voltage Rating: 75V; Supplier 1: Digi-Key; Supplier Part Number 1: 541-47.5KHCT-ND; Manufacturer Part Number: CRCW060347K5FKEA; RoHS: Yes; Category: Chip SMD Resistors; Stock 1: 47029; Pricing 1: 1=0,10000, 10=0,03400, 100=0,01390, 1000=0,00624, 2500=0,00542 (USD); Mount: Surface Mount; Case/Package: 0603; Case Code (Imperial): 0603; Case Code (Metric): 1608; Contact Plating: Tin; Weight: 7.1E-05oz; Size Code: 0603; Min Operating Temperature: -55°C; Max Operating Temperature: 155°C; Tolerance: 1%; Packaging: Tape and Reel; Resistor Type: Thick Film; Voltage Rating (DC): 75V; Number of Terminations: 2; Termination: SMD/SMT; Max Power Dissipation: 100mW; Series: CRCW; Package Quantity: 10; Resistance Tolerance: 1%; Features: Automotive AEC-Q200; Construction: Rectangular; Technology: THICK FILM; Length: 1.55mm; Width: 0.85mm; Height: 0.45mm; Depth: 0.85mm; Radiation Hardening: No; RoHS Compliant: Yes; REACH SVHC: Unknown; Lead Free: Lead Free; Military Standard: Not; ComponentLink1URL: https://datasheet.ciiva.com/11810/0900766b80d98afc-11810543.pdf?src-supplier=RSComponents; ComponentLink1Description: https://datasheet.ciiva.com/11810/0900766b80d98afc-11810543.pdf?src-supplier=RSComponents; ComponentLink2URL: https://datasheet.ciiva.com/2465/dcrcwe3-2465816.pdf?src-supplier=Digi-Key; ComponentLink2Description: https://datasheet.ciiva.com/2465/dcrcwe3-2465816.pdf?src-supplier=Digi-Key; ComponentLink3URL: https://datasheet.ciiva.com/7841/1697337-7841832.pdf?src-supplier=Element14; ComponentLink3Description: https://datasheet.ciiva.com/7841/1697337-7841832.pdf?src-supplier=Element14; ComponentLink4URL: https://datasheet.ciiva.com/2465/dcrcwe3-2465817.pdf?src-supplier=Digi-Key; ComponentLink4Description: https://datasheet.ciiva.com/2465/dcrcwe3-2465817.pdf?src-supplier=Digi-Key; ComponentLink5URL: https://datasheet.ciiva.com/7841/125364-7841833.pdf?src-supplier=Element14; ComponentLink5Description: https://datasheet.ciiva.com/7841/125364-7841833.pdf?src-supplier=Element14; ComponentLink6URL: https://datasheet.ciiva.com/2465/dcrcwe3-2465818.pdf?src-supplier=Digi-Key; ComponentLink6Description: https://datasheet.ciiva.com/2465/dcrcwe3-2465818.pdf?src-supplier=Digi-Key; ComponentLink7URL: https://datasheet.ciiva.com/16769/70201119-16769373.pdf?src-supplier=Allied+Electronics; ComponentLink7Description: https://datasheet.ciiva.com/16769/70201119-16769373.pdf?src-supplier=Allied+Electronics; ComponentLink8URL: https://datasheet.ciiva.com/16893/dcrcwe3-16893437.pdf?src-supplier=Avnet+Europe; ComponentLink8Description: https://datasheet.ciiva.com/16893/dcrcwe3-16893437.pdf?src-supplier=Avnet+Europe
R13 R14 = CRCW0603330KFKEA: Res Thick Film 0603 330K Ohm 1% 1/10W 100ppm/C Molded SMD Paper T/R; Manufacturer: Vishay; Resistance: 330kR; Power Rating: 100mW; Voltage Rating: 75V; Temperature Coefficient: 100ppm/°C; Supplier 1: Digi-Key; Supplier Part Number 1: 541-330KHCT-ND; Manufacturer Part Number: CRCW0603330KFKEA; RoHS: Yes; Category: Chip SMD Resistors; Stock 1: 470; Pricing 1: 1=0,10000, 10=0,03400, 100=0,01390, 1000=0,00624, 2500=0,00542 (USD); Mount: Surface Mount; Case/Package: 0603; Number of Pins: 2; Case Code (Imperial): 0603; Case Code (Metric): 1608; Contact Plating: Tin; Weight: 7.1E-05oz; Min Operating Temperature: -55°C; Max Operating Temperature: 155°C; Resistor Type: Thick Film; Tolerance: 1%; Packaging: Tape and Reel; Series: CRCW; Resistance Tolerance: 1%; Package Quantity: 10; Number of Terminations: 2; Max Power Dissipation: 100mW; Termination: SMD/SMT; Voltage Rating (DC): 75V; Construction: Rectangular; Features: Automotive AEC-Q200; Technology: THICK FILM; Working Voltage: 75V; Length: 1.55mm; Width: 0.85mm; Height: 0.45mm; Depth: 0.85mm; Radiation Hardening: No; RoHS Compliant: Yes; REACH SVHC: Unknown; Military Standard: Not; Lead Free: Lead Free; ComponentLink1URL: https://datasheet.ciiva.com/11810/0900766b80d98afc-11810796.pdf?src-supplier=RSComponents; ComponentLink1Description: https://datasheet.ciiva.com/11810/0900766b80d98afc-11810796.pdf?src-supplier=RSComponents; ComponentLink2URL: https://datasheet.ciiva.com/7673/1697337-7673301.pdf?src-supplier=Element14; ComponentLink2Description: https://datasheet.ciiva.com/7673/1697337-7673301.pdf?src-supplier=Element14; ComponentLink3URL: https://datasheet.ciiva.com/7673/1697337-7673302.pdf?src-supplier=Element14; ComponentLink3Description: https://datasheet.ciiva.com/7673/1697337-7673302.pdf?src-supplier=Element14; ComponentLink4URL: https://datasheet.ciiva.com/16778/70201119-16778744.pdf?src-supplier=Allied+Electronics; ComponentLink4Description: https://datasheet.ciiva.com/16778/70201119-16778744.pdf?src-supplier=Allied+Electronics; ComponentLink5URL: https://datasheet.ciiva.com/22708/1697337-22708424.pdf?src-supplier=Element14; ComponentLink5Description: https://datasheet.ciiva.com/22708/1697337-22708424.pdf?src-supplier=Element14; ComponentLink6URL: https://datasheet.ciiva.com/26317/fld-crcw-e3-data-en-26317177.pdf?src-supplier=Distrelec; ComponentLink6Description: https://datasheet.ciiva.com/26317/fld-crcw-e3-data-en-26317177.pdf?src-supplier=Distrelec; ComponentLink7URL: https://datasheet.ciiva.com/2465/dcrcwe3-2465930.pdf?src-supplier=Digi-Key; ComponentLink7Description: https://datasheet.ciiva.com/2465/dcrcwe3-2465930.pdf?src-supplier=Digi-Key; ComponentLink8URL: https://datasheet.ciiva.com/2465/dcrcwe3-2465931.pdf?src-supplier=Digi-Key; ComponentLink8Description: https://datasheet.ciiva.com/2465/dcrcwe3-2465931.pdf?src-supplier=Digi-Key; ComponentLink9URL: https://datasheet.ciiva.com/2465/dcrcwe3-2465932.pdf?src-supplier=Digi-Key; ComponentLink9Description: https://datasheet.ciiva.com/2465/dcrcwe3-2465932.pdf?src-supplier=Digi-Key; ComponentLink10URL: https://datasheet.ciiva.com/7792/125364-7792220.pdf?src-supplier=Element14; ComponentLink10Description: https://datasheet.ciiva.com/7792/125364-7792220.pdf?src-supplier=Element14; ComponentLink11URL: https://datasheet.ciiva.com/22870/70201119-22870764.pdf?src-supplier=Allied+Electronics; ComponentLink11Description: https://datasheet.ciiva.com/22870/70201119-22870764.pdf?src-supplier=Allied+Electronics; ComponentLink12URL: https://datasheet.ciiva.com/16203/dcrcwe3-16203007.pdf?src-supplier=Future+Electronics; ComponentLink12Description: https://datasheet.ciiva.com/16203/dcrcwe3-16203007.pdf?src-supplier=Future+Electronics
U5 = ADP160AUJZ-3.3-R7: ANALOG DEVICES         ADP160AUJZ-3.3-R7.             LDO VOLTAGE REGULATOR, FIXED, 3.3V, 150mA, TSOT-5; Number of Outputs: 1; Min Input Voltage: 2.2V; Max Input Voltage: 5.5V; Polarity: Positive; Accuracy: 2%; Min Current Limit: 220mA; Min Output Voltage: 1.2V; Power Supply Rejection Ratio (PSRR): 60dB; Nominal Supply Current: 42uA; Max Output Voltage: 4.2V; Quiescent Current: 860nA; Dropout Voltage: 120mV; Supplier 1: Digi-Key; Supplier Part Number 1: ADP160AUJZ-3.3-R7CT-ND; Manufacturer: Analog Devices; Manufacturer Part Number: ADP160AUJZ-3.3-R7; RoHS: Yes; Category: Voltage Regulators - Linear; Stock 1: 5750; Pricing 1: 1=1,19000, 10=1,06300, 25=1,00920, 100=0,77490, 250=0,68476, 500=0,64872, 1000=0,50456 (USD); Mount: Surface Mount; Case/Package: TSOT; Number of Pins: 5; Contact Plating: Tin,Matte; Min Operating Temperature: -40°C; Max Operating Temperature: 125°C; Max Output Current: 150mA; Output Voltage: 3.3V; Output Type: Fixed; Packaging: Cut Tape; Output Current: 150mA; Number of Regulators: 1; Operating Supply Current: 42uA; Max Supply Current: 42uA; Series: -; Nominal Output Voltage: 3.3V; Length: 2.9mm; Width: 1.6mm; Height: 0.9mm; Radiation Hardening: No; Lead Free: Contains Lead; RoHS Compliant: Yes; REACH SVHC: No SVHC; ComponentLink1URL: https://datasheet.ciiva.com/2040/adp160-161-162-163-2040742.pdf?src-supplier=Digi-Key; ComponentLink1Description: https://datasheet.ciiva.com/2040/adp160-161-162-163-2040742.pdf?src-supplier=Digi-Key; ComponentLink2URL: https://datasheet.ciiva.com/2040/adp160-161-162-163-2040744.pdf?src-supplier=Digi-Key; ComponentLink2Description: https://datasheet.ciiva.com/2040/adp160-161-162-163-2040744.pdf?src-supplier=Digi-Key; ComponentLink3URL: https://datasheet.ciiva.com/3223/adp160-161-162-163-3223369.pdf?src-supplier=Avnet; ComponentLink3Description: https://datasheet.ciiva.com/3223/adp160-161-162-163-3223369.pdf?src-supplier=Avnet; ComponentLink4URL: https://datasheet.ciiva.com/17365/adp160-161-162-163-17365691.pdf?src-supplier=Avnet+Europe; ComponentLink4Description: https://datasheet.ciiva.com/17365/adp160-161-162-163-17365691.pdf?src-supplier=Avnet+Europe; ComponentLink5URL: https://datasheet.ciiva.com/2040/adp160-161-162-163-2040743.pdf?src-supplier=Digi-Key; ComponentLink5Description: https://datasheet.ciiva.com/2040/adp160-161-162-163-2040743.pdf?src-supplier=Digi-Key; ComponentLink6URL: https://datasheet.ciiva.com/48694/001251311-da-01-en-ic-reg-l-adp160aujz-3-3-r7-tsot-23-5-adi-48694619.pdf?src-supplier=Conrad; ComponentLink6Description: https://datasheet.ciiva.com/48694/001251311-da-01-en-ic-reg-l-adp160aujz-3-3-r7-tsot-23-5-adi-48694619.pdf?src-supplier=Conrad